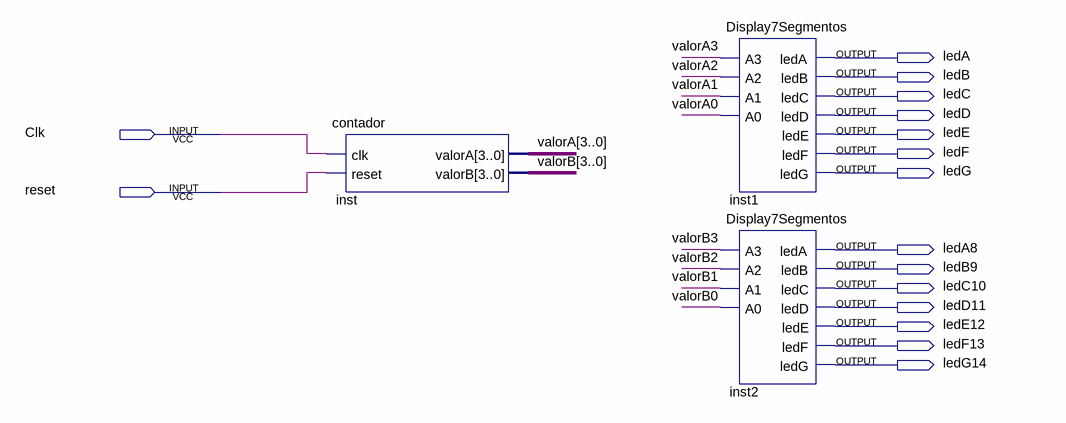
[diagram p0: schematic sheet]
// Quartus schematic escore.bdf as structural Verilog: 3 symbols, 16 pins
module escore (
  input  Clk,
  input  reset,
  output ledA,
  output ledB,
  output ledC,
  output ledD,
  output ledE,
  output ledF,
  output ledG,
  output ledA8,
  output ledB9,
  output ledC10,
  output ledD11,
  output ledE12,
  output ledF13,
  output ledG14
);

  wire [3:0] valorA, valorB;

  contador inst (.clk(Clk), .reset(reset), .valorA(valorA), .valorB(valorB));
  Display7Segmentos inst1 (
    .A3(valorA[3]), .A2(valorA[2]), .A1(valorA[1]), .A0(valorA[0]), .ledA(ledA), .ledB(ledB), .ledC(ledC),
    .ledD(ledD), .ledE(ledE), .ledF(ledF), .ledG(ledG));
  Display7Segmentos inst2 (
    .A3(valorB[3]), .A2(valorB[2]), .A1(valorB[1]), .A0(valorB[0]), .ledA(ledA8), .ledB(ledB9),
    .ledC(ledC10), .ledD(ledD11), .ledE(ledE12), .ledF(ledF13), .ledG(ledG14));
endmodule
